# Altium schematic sheet MAX9857A_audio_amp.SchDoc
size A; SheetNumber: 6; SheetTotal: 7
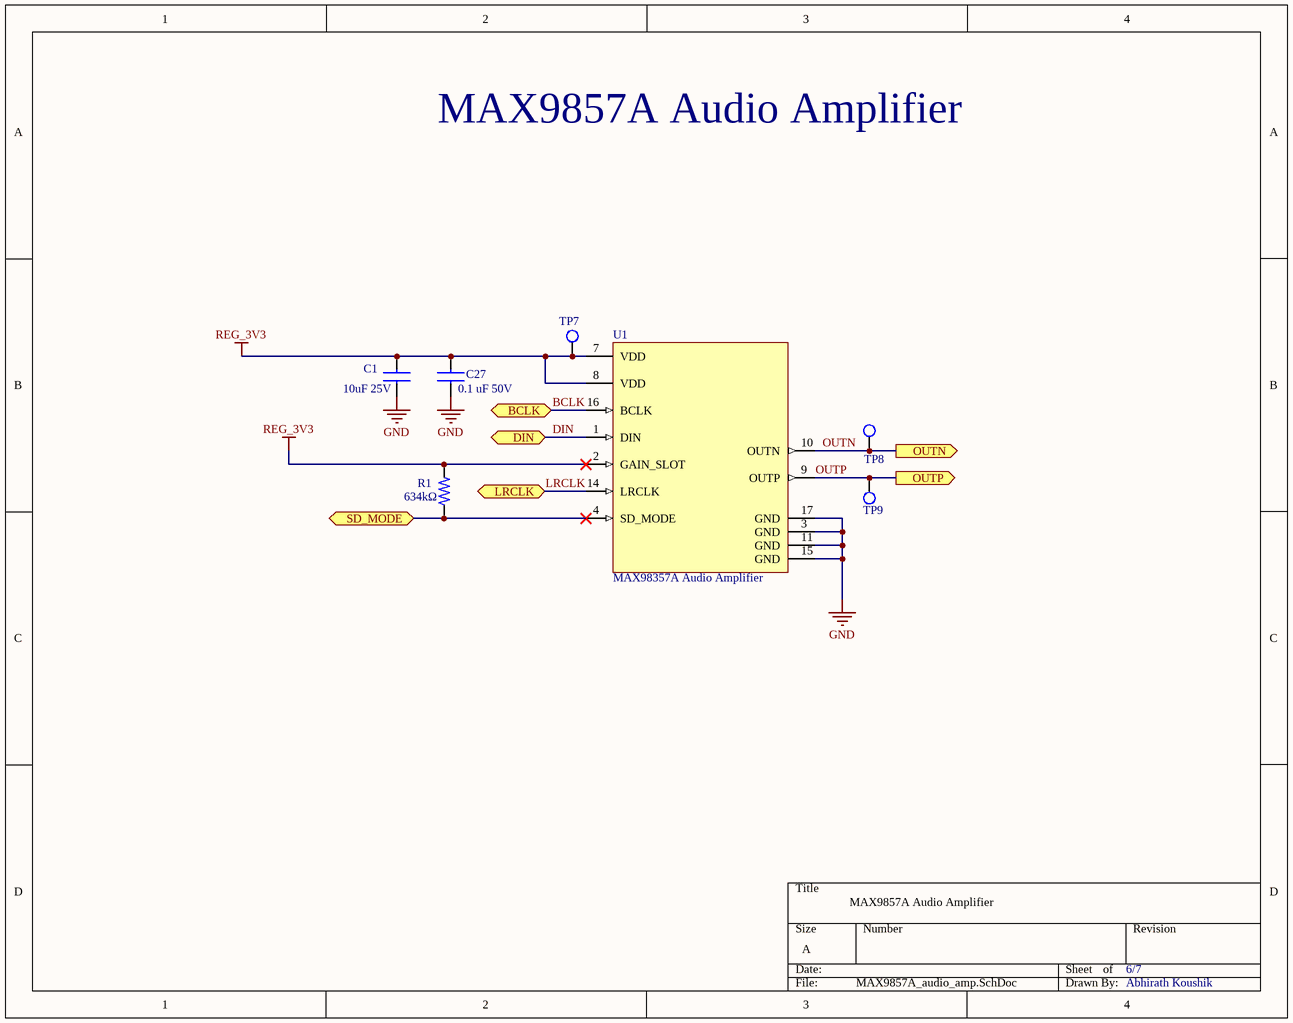
[diagram p0: MAX9857A_audio_amp.SchDoc]

## Parts
C1  10uF 25V  [CAP_10]
C27  0.1 uF 50V  [CAPC1608X90N]
R1  634kΩ  [634k 0603]
TP7  Test Point  [Test Point]  (value not drawn)  (net tie, no BOM)
TP8  Test Point  [Test Point]  (value not drawn)  (net tie, no BOM)
TP9  Test Point  [Test Point]  (value not drawn)  (net tie, no BOM)
U1  MAX98357A Audio Amplifier  [MAX98357_QFN_T1633_4]

## Ports
BCLK (bidir, see ESP32_SoC[3B]), DIN (bidir, see ESP32_SoC[3B]), LRCLK (bidir, see ESP32_SoC[3B]), OUTN (out, see mech_comp[1B]), OUTP (out, see mech_comp[2B]), SD_MODE (bidir, see ESP32_SoC[3B])

## Nets
GND: C1.1 C27.2 U1.3(GND) U1.11(GND) U1.15(GND) U1.17(GND)
REG_3V3: C1.2 C27.1 R1.2 TP7.1 U1.2(GAIN_SLOT) U1.7(VDD) U1.8(VDD)
BCLK: U1.16(BCLK) ; port BCLK
DIN: U1.1(DIN) ; port DIN
LRCLK: U1.14(LRCLK) ; port LRCLK
OUTN: TP8.1 U1.10(OUTN) ; port OUTN
OUTP: TP9.1 U1.9(OUTP) ; port OUTP
SD_MODE: R1.1 U1.4(SD_MODE) ; port SD_MODE

## Notes on the sheet
- MAX9857A Audio Amplifier
- 6/7
- Abhirath Koushik

## Library data of the parts
C1 = GRM21BR61E106KA73K: Ceramic Capacitor, Ceramic, 25V, 10% +Tol, 10% -Tol, X5R, 15% TC, 10uF, Surface Mount, 0805; Manufacturer: Murata; Manufacturer Lifecycle Status: IN PRODUCTION; Value: 10µF; Supplier: Avnet; Supplier Part Number: GRM21BR61E106KA73K; Manufacturer Part Number: GRM21BR61E106KA73K; RoHS: Compliant; Category: Ceramic Capacitors; Stock: 54000; Pricing: 10000=0.01987, 20000=0.01911, 40000=0.01892, 60000=0.01882, 80000=0.01872 (USD); Case/Package: 0805; Dielectric: X5R; Dielectric Material: Ceramic; Height: 1.25mm; Length: 2mm; Lifecycle Status: Production; Material: Ceramic; Max Operating Temperature: 85°C; Min Operating Temperature: -55°C; Mounting Technology: Surface Mount; Number of Terminals: 2; Packaging: Tape & Reel (TR); REACH SVHC: Yes; Schedule B: 8532240020, 8532240020|8532240020, 8532240020|8532240020|8532240020, 8532240020|8532240020|8532240020|8532240020; Thickness: 1.25mm; Tolerance: 10%; Voltage Rating: 25V; Voltage Rating (DC): 25V; Weight: 9.49709mg; Width: 1.25mm; ComponentLink1URL: https://datasheet.octopart.com:443/GRM21BR61E106KA73K-Murata-datasheet-149523495.pdf?src-supplier=Newark; ComponentLink1Description: https://datasheet.octopart.com:443/GRM21BR61E106KA73K-Murata-datasheet-149523495.pdf?src-supplier=Newark; ComponentLink2URL: https://datasheet.octopart.com:443/GRM21BR61E106KA73K-Murata-datasheet-141278247.pdf?src-supplier=Geoflip; ComponentLink2Description: https://datasheet.octopart.com:443/GRM21BR61E106KA73K-Murata-datasheet-141278247.pdf?src-supplier=Geoflip; ComponentLink3URL: https://datasheet.octopart.com:443/GRM21BR61E106KA73K-Murata-datasheet-165579666.pdf?src-supplier=TME; ComponentLink3Description: https://datasheet.octopart.com:443/GRM21BR61E106KA73K-Murata-datasheet-165579666.pdf?src-supplier=TME; ComponentLink4URL: https://datasheet.octopart.com:443/GRM21BR61E106KA73K-Murata-datasheet-140707569.pdf?src-supplier=Ciiva; ComponentLink4Description: https://datasheet.octopart.com:443/GRM21BR61E106KA73K-Murata-datasheet-140707569.pdf?src-supplier=Ciiva; ComponentLink5URL: https://datasheet.octopart.com:443/GRM21BR61E106KA73K-Murata-datasheet-138744870.pdf?src-supplier=Ciiva; ComponentLink5Description: https://datasheet.octopart.com:443/GRM21BR61E106KA73K-Murata-datasheet-138744870.pdf?src-supplier=Ciiva; ComponentLink6URL: https://datasheet.octopart.com:443/GRM21BR61E106KA73K-Murata-datasheet-99353849.pdf?src-supplier=Future+Electronics; ComponentLink6Description: https://datasheet.octopart.com:443/GRM21BR61E106KA73K-Murata-datasheet-99353849.pdf?src-supplier=Future+Electronics; ComponentLink7URL: https://datasheet.octopart.com/GRM21BR61E106KA73K-Murata-datasheet-12515295.pdf; ComponentLink7Description: https://datasheet.octopart.com/GRM21BR61E106KA73K-Murata-datasheet-12515295.pdf; ComponentLink8URL: https://datasheet.octopart.com/GRM21BR61E106KA73K-Murata-datasheet-12510076.pdf; ComponentLink8Description: https://datasheet.octopart.com/GRM21BR61E106KA73K-Murata-datasheet-12510076.pdf; ComponentLink9URL: https://datasheet.octopart.com/GRM21BR61E106KA73K-Murata-datasheet-11978611.pdf; ComponentLink9Description: https://datasheet.octopart.com/GRM21BR61E106KA73K-Murata-datasheet-11978611.pdf; ComponentLink10URL: https://datasheet.octopart.com/GRM21BR61E106KA73K-Murata-datasheet-10025737.pdf; ComponentLink10Description: https://datasheet.octopart.com/GRM21BR61E106KA73K-Murata-datasheet-10025737.pdf; ComponentLink11URL: https://datasheet.octopart.com/GRM21BR61E106KA73K-Murata-datasheet-8819587.pdf; ComponentLink11Description: https://datasheet.octopart.com/GRM21BR61E106KA73K-Murata-datasheet-8819587.pdf; ComponentLink12URL: https://datasheet.octopart.com/GRM21BR61E106KA73K-Murata-datasheet-14397508.pdf; ComponentLink12Description: https://datasheet.octopart.com/GRM21BR61E106KA73K-Murata-datasheet-14397508.pdf; ComponentLink13URL: http://sigma.octopart.com:80/reach_statement/Murata-company-16.pdf?src-supplier=Compliance+Statements; ComponentLink13Description: http://sigma.octopart.com:80/reach_statement/Murata-company-16.pdf?src-supplier=Compliance+Statements; Supplier 1: DigiKey; Supplier Part Number 1: 490-16824-1-ND
C27 = GCM31C5C1H104FA16L: 0.10uF Tol.1%. Rated voltage 50Vdc 125C SMD capacitor C0G(EIA) with capacitance; MF: Murata; Check_prices: https://www.snapeda.com/parts/GCM31C5C1H104FA16L/Murata/view-part/?ref=eda; Value: *; MP: GCM31C5C1H104FA16L; Purchase-URL: https://pricing.snapeda.com/search/part/GCM31C5C1H104FA16L/?ref=eda; SnapEDA_Link: https://www.snapeda.com/parts/GCM31C5C1H104FA16L/Murata/view-part/?ref=snap; Package: 3216 Murata; Digi-Key_Part_Number: 490-GCM31C5C1H104FA16LTR-ND
R1 = RMCF0603FT634K: Res Thick Film 0603 634K Ohm 1% 0.1W(1/10W) ±100ppm/C Pad SMD Automotive T/R; Manufacturer: Stackpole Electronics; Max Power Dissipation: 100mW; Temperature Coefficient: 100ppm/°C; Voltage Rating: 75V; Supplier: DigiKey; Supplier Part Number: 738-RMCF0603FT634KCT-ND; Manufacturer Part Number: RMCF0603FT634K; RoHS: Compliant; Category: Chip SMD Resistors; Stock: 6220; Pricing: 1=0.1, 10=0.02, 25=0.0144, 50=0.0114, 100=0.0091, 250=0.00696, 500=0.00574, 1000=0.0048 (USD); Case/Package: 0603; Case Code (Imperial): 0603; Case Code (Metric): 1608; China RoHS: Non-Compliant; Composition: Thick Film; Contact Plating: Tin; Features: Automotive AEC-Q200; Height: 450µm; Lead Free: Lead Free; Length: 1.5494mm; Lifecycle Status: Production; Max Operating Temperature: 155°C; Min Operating Temperature: -55°C; Mounting Technology: Surface Mount; Number of Terminals: 2; Number of Terminations: 2; Packaging: Cut Tape (CT); Power Dissipation: 100mW; Power Rating: 100mW; Radiation Hardening: No; REACH SVHC: Yes; Value: 634kΩ; Schedule B: 8533210045, 8533210045|8533210045|8533210045|8533210045|8533210045; Tolerance: 1%; Width: 800µm; Working Voltage: 75V; ComponentLink1URL: https://datasheet.octopart.com:443/RMCF0603FT634K-Stackpole-Electronics-datasheet-182148065.pdf?src-supplier=IHS; ComponentLink1Description: https://datasheet.octopart.com:443/RMCF0603FT634K-Stackpole-Electronics-datasheet-182148065.pdf?src-supplier=IHS; ComponentLink2URL: https://datasheet.octopart.com:443/RMCF0603FT634K-Stackpole-Electronics-datasheet-28504820.pdf?src-supplier=Upverter; ComponentLink2Description: https://datasheet.octopart.com:443/RMCF0603FT634K-Stackpole-Electronics-datasheet-28504820.pdf?src-supplier=Upverter; ComponentLink3URL: https://datasheet.octopart.com:443/RMCF0603FT634K-Stackpole-Electronics-datasheet-141193804.pdf?src-supplier=Master+Electronics; ComponentLink3Description: https://datasheet.octopart.com:443/RMCF0603FT634K-Stackpole-Electronics-datasheet-141193804.pdf?src-supplier=Master+Electronics; ComponentLink4URL: https://datasheet.octopart.com:443/RMCF0603FT634K-Stackpole-Electronics-datasheet-189104163.pdf?src-supplier=Master+Electronics; ComponentLink4Description: https://datasheet.octopart.com:443/RMCF0603FT634K-Stackpole-Electronics-datasheet-189104163.pdf?src-supplier=Master+Electronics; ComponentLink5URL: https://datasheet.octopart.com:443/RMCF0603FT634K-Stackpole-Electronics-datasheet-116606903.pdf?src-supplier=Master+Electronics; ComponentLink5Description: https://datasheet.octopart.com:443/RMCF0603FT634K-Stackpole-Electronics-datasheet-116606903.pdf?src-supplier=Master+Electronics; ComponentLink6URL: https://datasheet.octopart.com:443/RMCF0603FT634K-Stackpole-Electronics-datasheet-62091608.pdf?src-supplier=Stackpole+Electronics; ComponentLink6Description: https://datasheet.octopart.com:443/RMCF0603FT634K-Stackpole-Electronics-datasheet-62091608.pdf?src-supplier=Stackpole+Electronics; ComponentLink7URL: https://datasheet.octopart.com:443/RMCF0603FT634K-Stackpole-Electronics-datasheet-12534581.pdf?src-supplier=Stackpole+Electronics; ComponentLink7Description: https://datasheet.octopart.com:443/RMCF0603FT634K-Stackpole-Electronics-datasheet-12534581.pdf?src-supplier=Stackpole+Electronics; ComponentLink8URL: https://datasheet.octopart.com:443/RMCF0603FT634K-Stackpole-Electronics-datasheet-10788263.pdf?src-supplier=Stackpole+Electronics; ComponentLink8Description: https://datasheet.octopart.com:443/RMCF0603FT634K-Stackpole-Electronics-datasheet-10788263.pdf?src-supplier=Stackpole+Electronics; ComponentLink9URL: https://datasheet.octopart.com:443/RMCF0603FT634K-Stackpole-Electronics-datasheet-11547379.pdf?src-supplier=Future+Electronics; ComponentLink9Description: https://datasheet.octopart.com:443/RMCF0603FT634K-Stackpole-Electronics-datasheet-11547379.pdf?src-supplier=Future+Electronics; ComponentLink10URL: https://datasheet.octopart.com:443/RMCF0603FT634K-Stackpole-Electronics-datasheet-8359789.pdf?src-supplier=Future+Electronics; ComponentLink10Description: https://datasheet.octopart.com:443/RMCF0603FT634K-Stackpole-Electronics-datasheet-8359789.pdf?src-supplier=Future+Electronics; ComponentLink11URL: https://datasheet.octopart.com:443/RMCF0603FT634K-Stackpole-Electronics-datasheet-8324226.pdf?src-supplier=Future+Electronics; ComponentLink11Description: https://datasheet.octopart.com:443/RMCF0603FT634K-Stackpole-Electronics-datasheet-8324226.pdf?src-supplier=Future+Electronics; ComponentLink12URL: https://datasheet.octopart.com:443/RMCF0603FT634K-Stackpole-Electronics-datasheet-8088878.pdf?src-supplier=Future+Electronics; ComponentLink12Description: https://datasheet.octopart.com:443/RMCF0603FT634K-Stackpole-Electronics-datasheet-8088878.pdf?src-supplier=Future+Electronics; ComponentLink13URL: https://datasheet.octopart.com:443/RMCF0603FT634K-Stackpole-Electronics-datasheet-5313682.pdf?src-supplier=Future+Electronics; ComponentLink13Description: https://datasheet.octopart.com:443/RMCF0603FT634K-Stackpole-Electronics-datasheet-5313682.pdf?src-supplier=Future+Electronics; ComponentLink14URL: http://sigma.octopart.com:80/15940719/materials_sheet/Stackpole-Electronics-RMCF0603FT634K.pdf?src-supplier=Compliance+Statements; ComponentLink14Description: http://sigma.octopart.com:80/15940719/materials_sheet/Stackpole-Electronics-RMCF0603FT634K.pdf?src-supplier=Compliance+Statements; ComponentLink15URL: http://sigma.octopart.com:80/141158211/reach_statement/Stackpole-Electronics-RMCF0603FT634K.pdf?src-supplier=Compliance+Statements; ComponentLink15Description: http://sigma.octopart.com:80/141158211/reach_statement/Stackpole-Electronics-RMCF0603FT634K.pdf?src-supplier=Compliance+Statements; ComponentLink16URL: http://sigma.octopart.com:80/141158212/rohs_statement/Stackpole-Electronics-RMCF0603FT634K.pdf?src-supplier=Compliance+Statements; ComponentLink16Description: http://sigma.octopart.com:80/141158212/rohs_statement/Stackpole-Electronics-RMCF0603FT634K.pdf?src-supplier=Compliance+Statements
U1 = MAX98357AETE+T: MAX98357A Series 5.5 V 3.2 W PCM Input Class D Audio Power Amplifier - TQFN-16; Manufacturer: Analog Devices; Manufacturer Lifecycle Status: PRODUCTION; Max Junction Temperature (Tj): 150°C; Max Output current: 1.6A; Max Output Power: 3.2W; Max Power Dissipation: 1.666W; Max Supply Voltage: 5.5V; Min Supply Voltage: 2.5V; Number of Channels: 1; Power Supply Rejection Ratio (PSRR): 77dB; Voltage Gain: 15dB; Supplier: DigiKey; Supplier Part Number: MAX98357AETE+TCT-ND; Manufacturer Part Number: MAX98357AETE+T; RoHS: Compliant; Category: Amplifiers - Audio; Stock: 32222; Pricing: 1=3.19, 10=2.392, 25=2.1924, 100=1.9732, 250=1.86872, 500=1.80568, 1000=1.75383, 2500=1.69908, 5000=1.66609 (USD); Contact Plating: Tin; Height: 800µm; Lifecycle Status: Production; Max Operating Temperature: 85°C; Min Operating Temperature: -40°C; Mounting Technology: Surface Mount; Pins: 16; Output Power: 3.2W; Packaging: Tape & Reel; Radiation Hardening: No; Schedule B: 8542330000|8542330000|8542330000|8542330000|8542330000|8542330000|8542330000|8542330000|8542330000|8542330000|8542330000|8542330000|8542330000|8542330000|8542330000|8542330000|8542330000|8542330000|8542330000|8542330000|8542330000|8542330000|8542330000|85; ComponentLink1URL: https://octopart.com:443/opatz8j6/c1?t=rbGQiL7xnRFv-jqcItS1qOamAl3hhwp9AtC34ih8aMpMapIsYlR47c895uKfTTFbRijI_oYMwWz59DKrH8nIeKFcsko6OZBrwx-0gXxTU_2XU3pwQ0AXbbIdvYFz7RDX5km1YP4eIyWhkvgnY-az_-ZIULeLJWLAtaozgYWFAD-e5NfjwD9u1qbScvokYtMmtu59DLTci4bh3QZagTRfuiViQ01ezYh0pP8jAz62mr6Q9kisYBp9-aBQL0qKsBb1t9z3ifAzSJRbEG98U1VHtIW1whJm33z3aRCRTOci27GAt0PgzWqVSEBzsSE&src-supplier=Analog+Devices; ComponentLink1Description: https://octopart.com:443/opatz8j6/c1?t=rbGQiL7xnRFv-jqcItS1qOamAl3hhwp9AtC34ih8aMpMapIsYlR47c895uKfTTFbRijI_oYMwWz59DKrH8nIeKFcsko6OZBrwx-0gXxTU_2XU3pwQ0AXbbIdvYFz7RDX5km1YP4eIyWhkvgnY-az_-ZIULeLJWLAtaozgYWFAD-e5NfjwD9u1qbScvokYtMmtu59DLTci4bh3QZagTRfuiViQ01ezYh0pP8jAz62mr6Q9kisYBp9-aBQL0qKsBb1t9z3ifAzSJRbEG98U1VHtIW1whJm33z3aRCRTOci27GAt0PgzWqVSEBzsSE&src-supplier=Analog+Devices; ComponentLink2URL: https://datasheet.octopart.com:443/MAX98357AETE%2BT-Analog-Devices-datasheet-140103828.pdf?src-supplier=Upverter; ComponentLink2Description: https://datasheet.octopart.com:443/MAX98357AETE%2BT-Analog-Devices-datasheet-140103828.pdf?src-supplier=Upverter; ComponentLink3URL: https://datasheet.octopart.com:443/MAX98357AETE%2BT-Maxim-Integrated-datasheet-82537686.pdf?src-supplier=Upverter; ComponentLink3Description: https://datasheet.octopart.com:443/MAX98357AETE%2BT-Maxim-Integrated-datasheet-82537686.pdf?src-supplier=Upverter; ComponentLink4URL: https://sigma.octopart.com:443/141243535/technical_drawing/Maxim-Integrated-MAX98357AETE%2BT.pdf?src-supplier=Upverter; ComponentLink4Description: https://sigma.octopart.com:443/141243535/technical_drawing/Maxim-Integrated-MAX98357AETE%2BT.pdf?src-supplier=Upverter; ComponentLink5URL: https://datasheet.octopart.com:443/MAX98357AETE%2BT-Maxim-Integrated-datasheet-134531866.pdf?src-supplier=Augswan; ComponentLink5Description: https://datasheet.octopart.com:443/MAX98357AETE%2BT-Maxim-Integrated-datasheet-134531866.pdf?src-supplier=Augswan; ComponentLink6URL: https://sigma.octopart.com:443/140082349/technical_drawing/Maxim-Integrated-MAX98357AETE%2BT.pdf?src-supplier=ShanghaiCT; ComponentLink6Description: https://sigma.octopart.com:443/140082349/technical_drawing/Maxim-Integrated-MAX98357AETE%2BT.pdf?src-supplier=ShanghaiCT; ComponentLink7URL: https://datasheet.octopart.com/MAX98357AETE%2BT-Maxim-Integrated-datasheet-38886134.pdf; ComponentLink7Description: https://datasheet.octopart.com/MAX98357AETE%2BT-Maxim-Integrated-datasheet-38886134.pdf; ComponentLink8URL: https://datasheet.octopart.com:443/MAX98357AETE%2BT-Maxim-Integrated-datasheet-8516998.pdf?src-supplier=Future+Electronics; ComponentLink8Description: https://datasheet.octopart.com:443/MAX98357AETE%2BT-Maxim-Integrated-datasheet-8516998.pdf?src-supplier=Future+Electronics; ComponentLink9URL: http://sigma.octopart.com:80/conflict_mineral_statement/Analog-Devices-company-33.pdf?src-supplier=Compliance+Statements; ComponentLink9Description: http://sigma.octopart.com:80/conflict_mineral_statement/Analog-Devices-company-33.pdf?src-supplier=Compliance+Statements; ComponentLink10URL: http://sigma.octopart.com:80/conflict_mineral_statement/Maxim-Integrated-company-65.pdf?src-supplier=Compliance+Statements; ComponentLink10Description: http://sigma.octopart.com:80/conflict_mineral_statement/Maxim-Integrated-company-65.pdf?src-supplier=Compliance+Statements; ComponentLink11URL: http://sigma.octopart.com:80/rohs_statement/Maxim-Integrated-company-66.pdf?src-supplier=Compliance+Statements; ComponentLink11Description: http://sigma.octopart.com:80/rohs_statement/Maxim-Integrated-company-66.pdf?src-supplier=Compliance+Statements; ComponentLink12URL: http://sigma.octopart.com:80/reach_statement/Maxim-Integrated-company-67.pdf?src-supplier=Compliance+Statements; ComponentLink12Description: http://sigma.octopart.com:80/reach_statement/Maxim-Integrated-company-67.pdf?src-supplier=Compliance+Statements; ComponentLink13URL: https://octopart.com:443/opatz8j6/c1?t=Pg_jOPeQ0KB8mixqCi9XlKFd991EneWNIWhTuR4ggpXOxq_2hmEpFZ4ABIzO8IbKBplSXT-Hji7LqbKxlqGh42oSk7Yw5IptCGWxBrpyWOfl7PgiGhzZr-TFxQHVPpDlqgviX3Tmouz7pJif7sOYsNFIwR7JIBi7xEYhk-W46cGuoEapX8tqTOLvoEHPzVIVt0N2U3ngERHp6HlR5xk0W22LnIJw3KsjqPF30bdvm5-KCskf65kxdEHLEp6OSXzqiSR-KiskveOZJCnmUr3Q_MsaqijrnYy9jyKohTB5jnQCYD0fJJKaiVL3zsA&src-supplier=Compliance+Statements; ComponentLink13Description: https://octopart.com:443/opatz8j6/c1?t=Pg_jOPeQ0KB8mixqCi9XlKFd991EneWNIWhTuR4ggpXOxq_2hmEpFZ4ABIzO8IbKBplSXT-Hji7LqbKxlqGh42oSk7Yw5IptCGWxBrpyWOfl7PgiGhzZr-TFxQHVPpDlqgviX3Tmouz7pJif7sOYsNFIwR7JIBi7xEYhk-W46cGuoEapX8tqTOLvoEHPzVIVt0N2U3ngERHp6HlR5xk0W22LnIJw3KsjqPF30bdvm5-KCskf65kxdEHLEp6OSXzqiSR-KiskveOZJCnmUr3Q_MsaqijrnYy9jyKohTB5jnQCYD0fJJKaiVL3zsA&src-supplier=Compliance+Statements; Supplier 1: DigiKey; Supplier Part Number 1: MAX98357AETE+TCT-ND